# EAGLE design tableau (EAGLE 8.4.3)
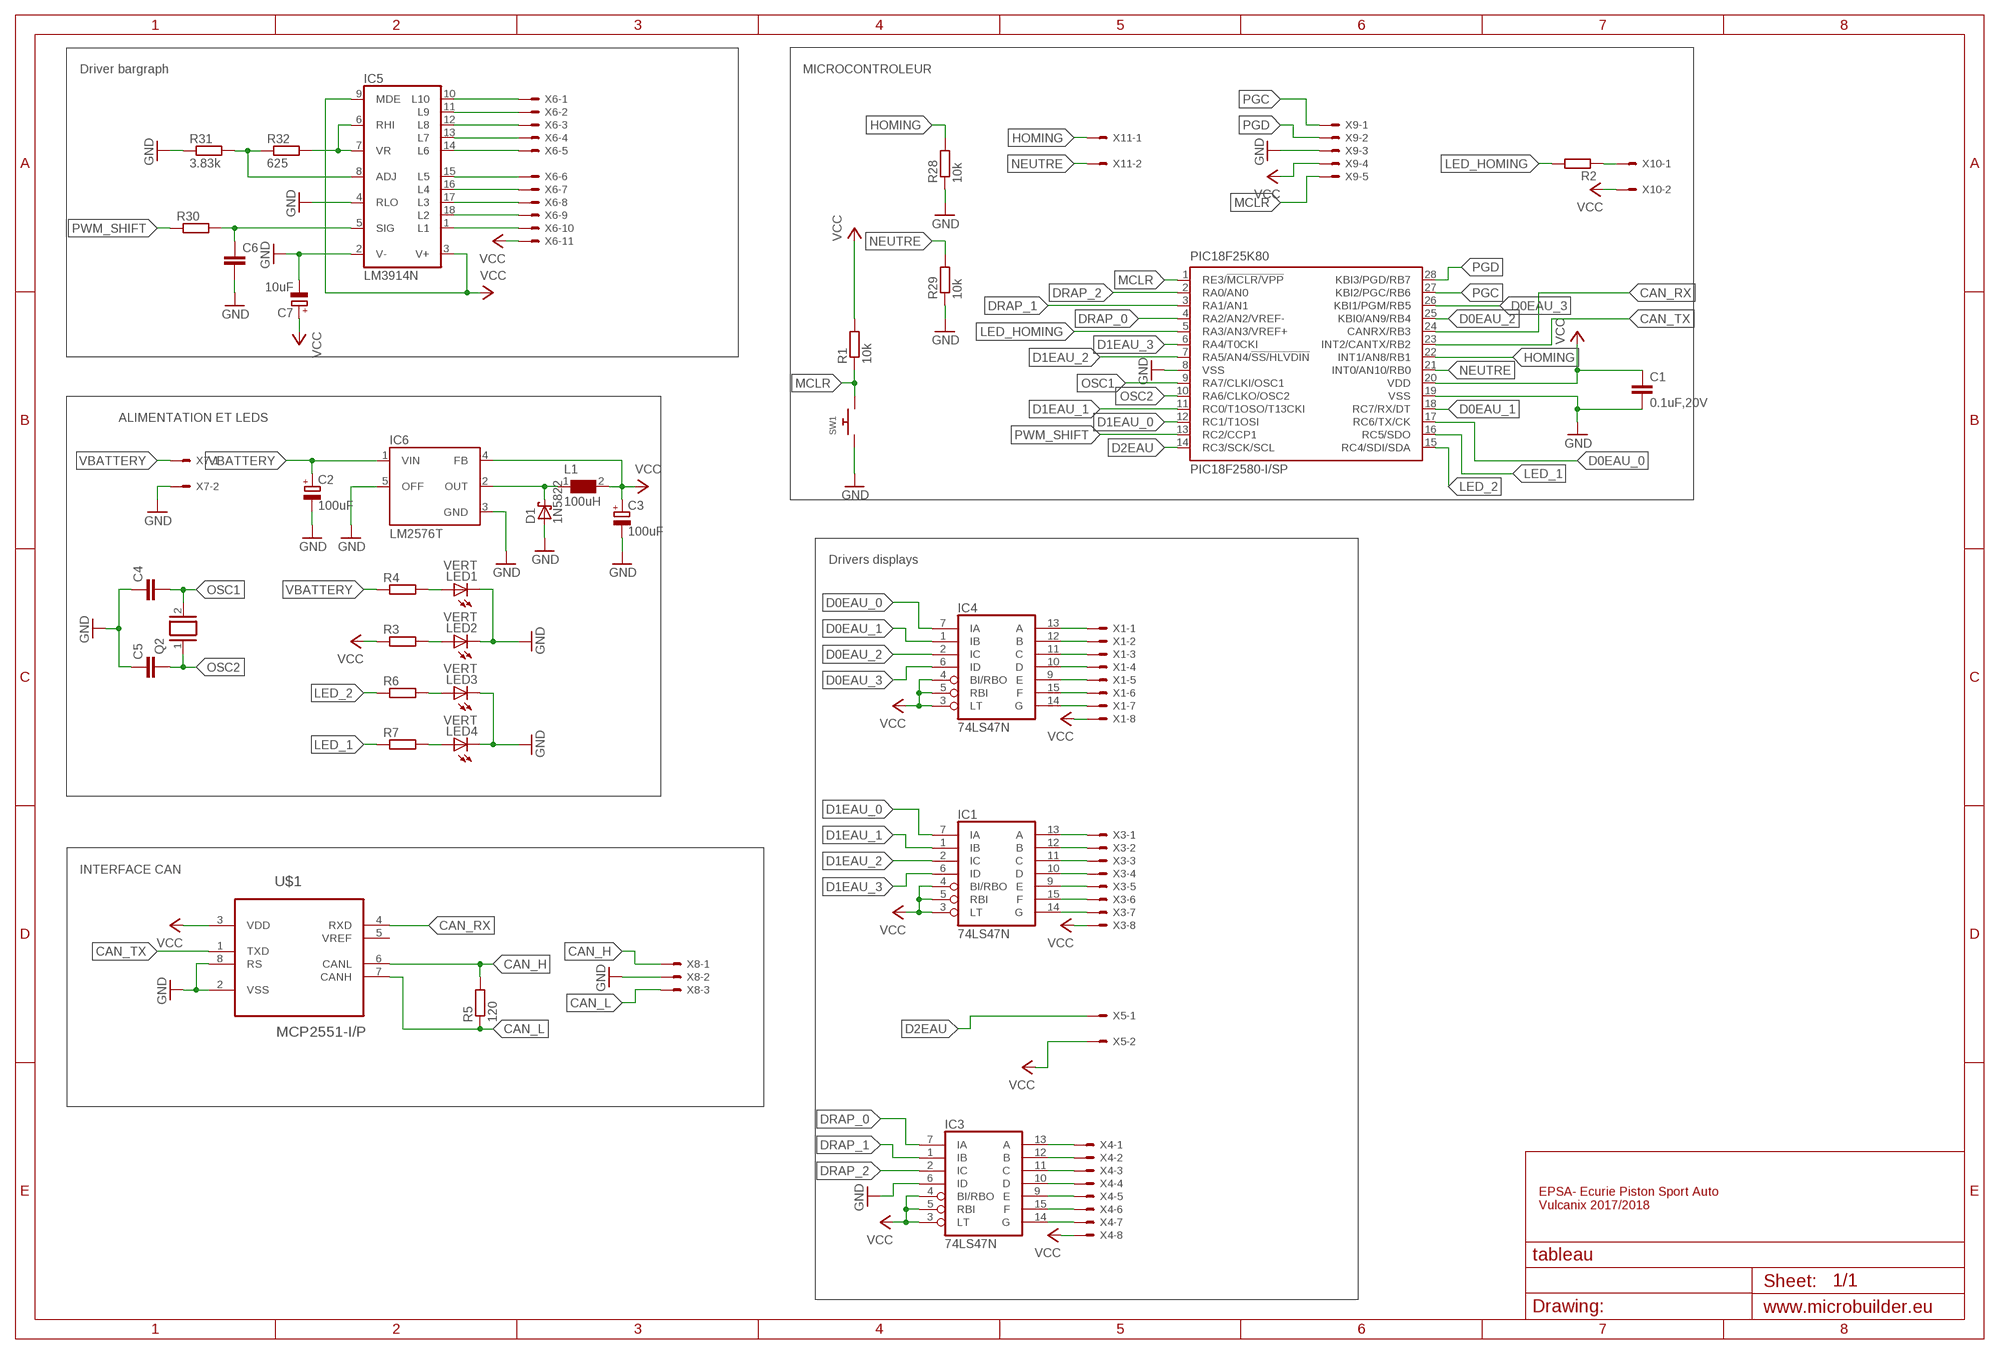
[diagram p0: schematic, sheet 1]

## Parts
C1  0.1uF,20V  C-EU025-025X050  [C025-025X050]
C2  100uF  CPOL-EUE2-5  [E2-5]
C3  100uF  CPOL-EUE2-5  [E2-5]
C4  C-EU025-030X050  [C025-030X050]
C5  C-EU025-030X050  [C025-030X050]
C6  C-EU025-025X050  [C025-025X050]
C7  10uF  CPOL-EUE2-5  [E2-5]
D1  1N5822  SCHOTTKY-DIODEDO201T15  [DO201T15]
IC1  74LS47N  [DIL16]
IC3  74LS47N  [DIL16]
IC4  74LS47N  [DIL16]
IC5  LM3914N  [DIL18]
IC6  LM2576T  [TO220-5]
L1  100uH  WE-TI-744743102_8012B  [WE-TI_8012B]
LED1  VERT  LED3MM  [LED3MM]
LED2  VERT  LED3MM  [LED3MM]
LED3  VERT  LED3MM  [LED3MM]
LED4  VERT  LED3MM  [LED3MM]
PIC18F25K80  PIC18F2580-I/SP  [DIL28-3]
Q2  XTAL/S  [QS]
R1  10k  R-EU_0204/7  [0204/7]
R2  R-EU_0204/7  [0204/7]
R3  R-EU_0204/7  [0204/7]
R4  R-EU_0204/7  [0204/7]
R5  120  R-EU_0204/7  [0204/7]
R6  R-EU_0204/7  [0204/7]
R7  R-EU_0204/7  [0204/7]
R28  10k  R-EU_0204/7  [0204/7]
R29  10k  R-EU_0204/7  [0204/7]
R30  R-EU_0204/7  [0204/7]
R31  3.83k  R-EU_0204/7  [0204/7]
R32  625  R-EU_0204/7  [0204/7]
SW1  SWITCH_PUSHBUTTONSOFTTOUCHSMD_SJ  [PUSHBUTTON_SMD_SJ]
U$1  MCP2551-I/P  [DIP254P762X432-8]
X1  KK-156-8  [KK-156-8]
X3  KK-156-8  [KK-156-8]
X4  KK-156-8  [KK-156-8]
X5  KK-156-2  [KK-156-2]
X6  KK-156-11  [KK-156-11]
X7  KK-156-2  [KK-156-2]
X8  KK-156-3  [KK-156-3]
X9  KK-156-5  [KK-156-5]
X10  KK-156-2  [KK-156-2]
X11  KK-156-2  [KK-156-2]

## Nets
CAN_H: R5.2 U$1.6(CANL) X8.1
CAN_L: R5.1 U$1.7(CANH) X8.3
CAN_RX: PIC18F25K80.24(CANRX/RB3) U$1.4(RXD)
CAN_TX: PIC18F25K80.23(INT2/CANTX/RB2) U$1.1(TXD)
D0EAU_0: IC4.7(IA) PIC18F25K80.17(RC6/TX/CK)
D0EAU_1: IC4.1(IB) PIC18F25K80.18(RC7/RX/DT)
D0EAU_2: IC4.2(IC) PIC18F25K80.25(KBI0/AN9/RB4)
D0EAU_3: IC4.6(ID) PIC18F25K80.26(KBI1/PGM/RB5)
D1EAU_0: IC1.7(IA) PIC18F25K80.12(RC1/T1OSI)
D1EAU_1: IC1.1(IB) PIC18F25K80.11(RC0/T1OSO/T13CKI)
D1EAU_2: IC1.2(IC) PIC18F25K80.7(RA5/AN4/!SS/HLVDIN)
D1EAU_3: IC1.6(ID) PIC18F25K80.6(RA4/T0CKI)
D2EAU: PIC18F25K80.14(RC3/SCK/SCL) X5.1
DRAP_0: IC3.7(IA) PIC18F25K80.4(RA2/AN2/VREF-)
DRAP_1: IC3.1(IB) PIC18F25K80.3(RA1/AN1)
DRAP_2: IC3.2(IC) PIC18F25K80.2(RA0/AN0)
GND: C1.2 C2.- C3.- C4.1 C5.1 C6.2 C7.- D1.A IC3.6(ID) IC5.2(V-) IC5.4(RLO) IC6.3(GND) IC6.5(OFF) LED1.K(C) LED2.K(C) LED3.K(C) LED4.K(C) PIC18F25K80.8(VSS) PIC18F25K80.19(VSS) R28.1 R29.1 R31.1 SW1.P$1 U$1.2(VSS) U$1.8(RS) X7.2 X8.2 X9.3
HOMING: PIC18F25K80.22(INT1/AN8/RB1) R28.2 X11.1
LED_1: PIC18F25K80.16(RC5/SDO) R7.1
LED_2: PIC18F25K80.15(RC4/SDI/SDA) R6.1
LED_HOMING: PIC18F25K80.5(RA3/AN3/VREF+) R2.2
MCLR: PIC18F25K80.1(RE3/!MCLR/VPP) R1.1 SW1.P$2 X9.5
N$1: LED1.A R4.2
N$2: IC4.13(A) X1.1
N$3: LED2.A R3.2
N$4: R2.1 X10.1
N$6: IC4.12(B) X1.2
N$7: IC4.11(C) X1.3
N$8: IC4.10(D) X1.4
N$9: IC4.9(E) X1.5
N$10: IC4.15(F) X1.6
N$11: IC4.14(G) X1.7
N$12: IC1.13(A) X3.1
N$13: IC1.12(B) X3.2
N$14: IC1.11(C) X3.3
N$15: IC1.10(D) X3.4
N$16: IC1.9(E) X3.5
N$17: IC1.15(F) X3.6
N$18: IC1.14(G) X3.7
N$19: IC3.13(A) X4.1
N$20: IC3.12(B) X4.2
N$21: IC3.11(C) X4.3
N$23: IC3.10(D) X4.4
N$24: IC3.9(E) X4.5
N$25: IC3.15(F) X4.6
N$26: IC3.14(G) X4.7
N$27: IC5.10(L10) X6.1
N$28: IC5.11(L9) X6.2
N$29: IC5.12(L8) X6.3
N$30: IC5.13(L7) X6.4
N$31: IC5.14(L6) X6.5
N$32: IC5.15(L5) X6.6
N$33: IC5.16(L4) X6.7
N$34: IC5.17(L3) X6.8
N$35: IC5.18(L2) X6.9
N$36: IC5.1(L1) X6.10
N$38: LED3.A R6.2
N$39: LED4.A R7.2
N$59: C6.1 IC5.5(SIG) R30.2
N$60: IC5.6(RHI) IC5.7(VR) R32.2
N$61: IC5.8(ADJ) R31.2 R32.1
N$62: D1.C IC6.2(OUT) L1.1
NEUTRE: PIC18F25K80.21(INT0/AN10/RB0) R29.2 X11.2
OSC1: C4.2 PIC18F25K80.9(RA7/CLKI/OSC1) Q2.2
OSC2: C5.2 PIC18F25K80.10(RA6/CLKO/OSC2) Q2.1
PGC: PIC18F25K80.27(KBI2/PGC/RB6) X9.1
PGD: PIC18F25K80.28(KBI3/PGD/RB7) X9.2
PWM_SHIFT: PIC18F25K80.13(RC2/CCP1) R30.1
VBATTERY: C2.+ IC6.1(VIN) R4.1 X7.1
VCC: C1.1 C3.+ C7.+ IC1.3(LT) IC1.4(BI/RBO) IC1.5(RBI) IC3.3(LT) IC3.4(BI/RBO) IC3.5(RBI) IC4.3(LT) IC4.4(BI/RBO) IC4.5(RBI) IC5.3(V+) IC5.9(MDE) IC6.4(FB) L1.2 PIC18F25K80.20(VDD) R1.2 R3.1 U$1.3(VDD) X1.8 X3.8 X4.8 X5.2 X6.11 X9.4 X10.2
Unconnected: U$1.5(VREF)

## Notes on the sheet
- Driver bargraph | MICROCONTROLEUR
- ALIMENTATION ET LEDS
- Drivers displays
- INTERFACE CAN
- EPSA- Ecurie Piston Sport Auto
  Vulcanix 2017/2018

## Power pins joined to a net without a drawn wire
GND: IC1.8(GND) IC3.8(GND) IC4.8(GND)
VCC: IC1.16(VCC) IC3.16(VCC) IC4.16(VCC)

## Library data of the parts
C1 C4 C5 = rcl:C-EU: CAPACITOR, European symbol
C2 C3 C7 = rcl:CPOL-EU: POLARIZED CAPACITOR, European symbol
C6 = resistor:C-EU: CAPACITOR, European symbol
D1 = diode:SCHOTTKY-DIODE: Schottky Diode
IC1 IC3 IC4 = 74xx-eu:74*47: BCD to seven segment DECODER/DRIVER Source: http://www.ee.washington.edu/stores/DataSheets/74ls/74ls47.pdf
IC5 = linear:LM3914N: LED DRIVER senses analog voltage levels and drives 10 LEDs
IC6 = v-reg-3:LM2576: National Semiconductor <http://www.national.com> 3.0A "Simple Switcher"(c) 52kHz, Vout 1.23-37V (HV: 57V), Vin 40V (HV: 60V), 50µA standby current
L1 = WE-TI:WE-TI: Radial Leaded Wire Wound Inductor WE-TI - Radial through-hole inductor - High saturation core material - Small size - maximum current up to 7,5 A -- Signal filtering -- NF-switches, switching power supply for small and medium voltage -- Power supply filter; MPN: 744743102; OC_FARNELL: 2211743; OC_NEWARK: 44W4682; PACKAGE: 8012-B; SUPPLIER: WURTH ELEKTRONIK
LED1-LED4 = led:LED: LED OSRAM: - CHIPLED LG R971, LG N971, LY N971, LG Q971, LY Q971, LO R971, LY R971 LH N974, LH R974 LS Q976, LO Q976, LY Q976 LO Q996 - Hyper CHIPLED LW Q18S LB Q993, LB Q99A, LB R99A - SideLED LS A670, LO A670, LY A670, LG A670, LP A670 LB A673, LV A673, LT A673, LW A673 LH A674 LY A675 LS A676, LA A676, LO A676, LY A676, LW A676 LS A679, LY A679, LG A679 - Hyper Micro SIDELED® LS Y876, LA Y876, LO Y876, LY Y876 LT Y87S - SmartLED LW L88C, LW L88S LB L89C, LB L89S, LG L890 LS L89K, LO L89K, LY L89K LS L896, LA L896, LO L896, LY L896 - TOPLED LS T670, LO T670, LY T670, LG T670, LP T670 LSG T670, LSP T670, LSY T670, LOP T670, LYG T670 LG T671, LOG T671, LSG T671 LB T673, LV T673, LT T673, LW T673 LH T674 LS T676, LA T676, LO T676, LY T676, LB T676, LH T676, LSB T676, LW T676 LB T67C, LV T67C, LT T67C, LS T67K, LO T67K, LY T67K, LW E67C LS E67B, LA E67B, LO E67B, LY E67B, LB E67C, LV E67C, LT E67C LW T67C LS T679, LY T679, LG T679 LS T770, LO T770, LY T770, LG T770, LP T770 LB T773, LV T773, LT T773, LW T773 LH T774 LS E675, LA E675, LY E675, LS T675 LS T776, LA T776, LO T776, LY T776, LB T776 LHGB T686 LT T68C, LB T68C - Hyper Mini TOPLED® LB M676 - Mini TOPLED Santana® LG M470 LS M47K, LO M47K, LY M47K Source: http://www.osram.convergy.de LUXEON: - LUMILED® LXK2-PW12-R00, LXK2-PW12-S00, LXK2-PW14-U00, LXK2-PW14-V00 LXK2-PM12-R00, LXK2-PM12-S00, LXK2-PM14-U00 LXK2-PE12-Q00, LXK2-PE12-R00, LXK2-PE12-S00, LXK2-PE14-T00, LXK2-PE14-U00 LXK2-PB12-K00, LXK2-PB12-L00, LXK2-PB12-M00, LXK2-PB14-N00, LXK2-PB14-P00, LXK2-PB14-Q00 LXK2-PR12-L00, LXK2-PR12-M00, LXK2-PR14-Q00, LXK2-PR14-R00 LXK2-PD12-Q00, LXK2-PD12-R00, LXK2-PD12-S00 LXK2-PH12-R00, LXK2-PH12-S00 LXK2-PL12-P00, LXK2-PL12-Q00, LXK2-PL12-R00 Source: www.luxeon.com KINGBRIGHT: KA-3528ASYC Source: www.kingbright.com
PIC18F25K80 = microchip:PIC18F2*80: 28-Pin Enhanced Flash Microcontrollers with ECAN(TM) Technology 10-Bit A/D and nanoWatt Technology Source: http://www.microchip.com .. 39637a.pdf; MF: MICROCHIP; MPN: PIC18F2580-I/SP; OC_FARNELL: 9321276; OC_NEWARK: 71J7244
Q2 = special:XTAL/S: CRYSTAL
R1-R7 R28-R32 = resistor:R-EU_: RESISTOR, European symbol
SW1 = microbuilder:SWITCH_PUSHBUTTON: Buttons SOFTTOUCHSMD_SJ - Soft touch temporary push button (Super Junk Akihabara) Compatible with SKPMANE010 [Mouser: 688-SKPMAN]
U$1 = mcp2551:MCP2551-I/P: High-Speed CAN Transceiver; DESCRIPTION: CAN CTRL; MPN: MCP2551-I/P; OC_FARNELL: 1292240; OC_NEWARK: 61K2947; PACKAGE: PDIP-8; SUPPLIER: Microchip
X1 X3 X4 = con-molex:KK-156-8: KK 156 HEADER Source: http://www.molex.com/pdm_docs/sd/026604100_sd.pdf; OC_FARNELL: unknown; OC_NEWARK: unknown
X5 X7 X10 X11 = con-molex:KK-156-2: KK 156 HEADER Source: http://www.molex.com/pdm_docs/sd/026604100_sd.pdf; OC_FARNELL: unknown; OC_NEWARK: unknown
X6 = con-molex:KK-156-11: KK 156 HEADER Source: http://www.molex.com/pdm_docs/sd/026604100_sd.pdf; OC_FARNELL: unknown; OC_NEWARK: unknown
X8 = con-molex:KK-156-3: KK 156 HEADER Source: http://www.molex.com/pdm_docs/sd/026604100_sd.pdf; OC_FARNELL: unknown; OC_NEWARK: unknown
X9 = con-molex:KK-156-5: KK 156 HEADER Source: http://www.molex.com/pdm_docs/sd/026604100_sd.pdf; OC_FARNELL: unknown; OC_NEWARK: unknown

## Net classes
0 default: width 0.356 mm, clearance 0.356 mm

## Board
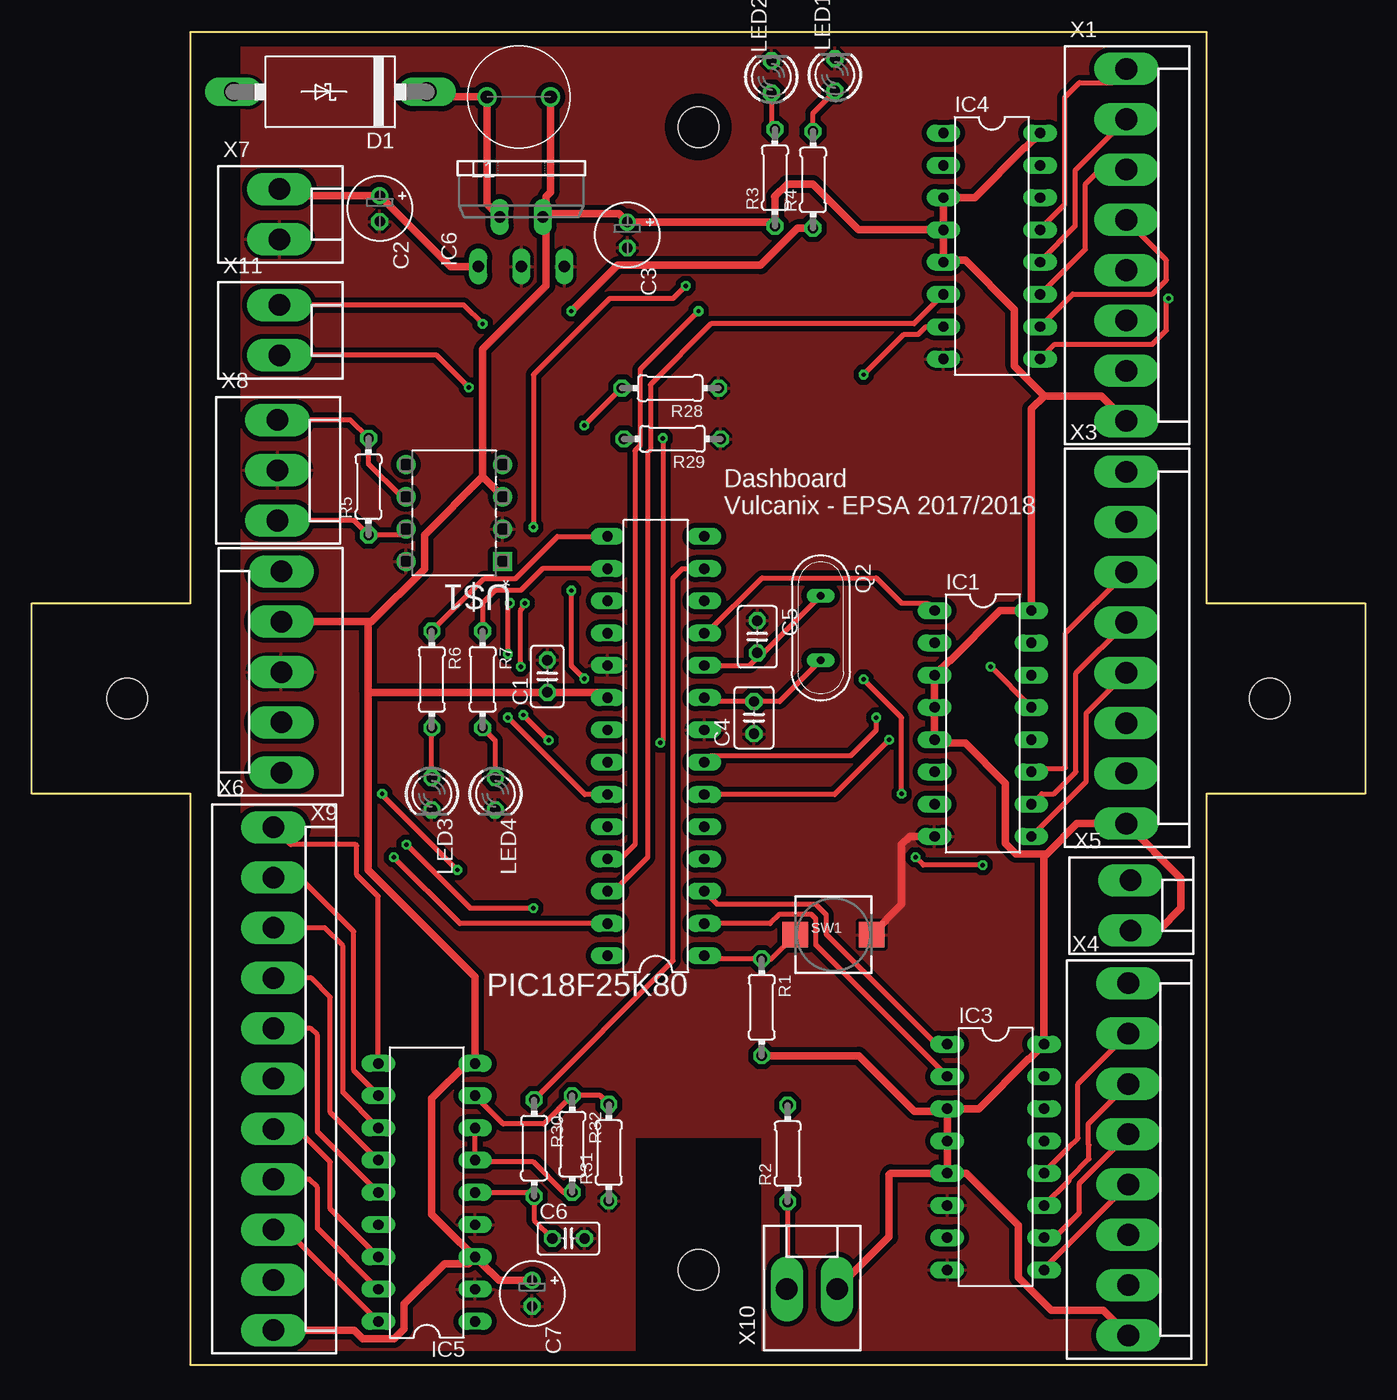
[diagram p1: board, top side]
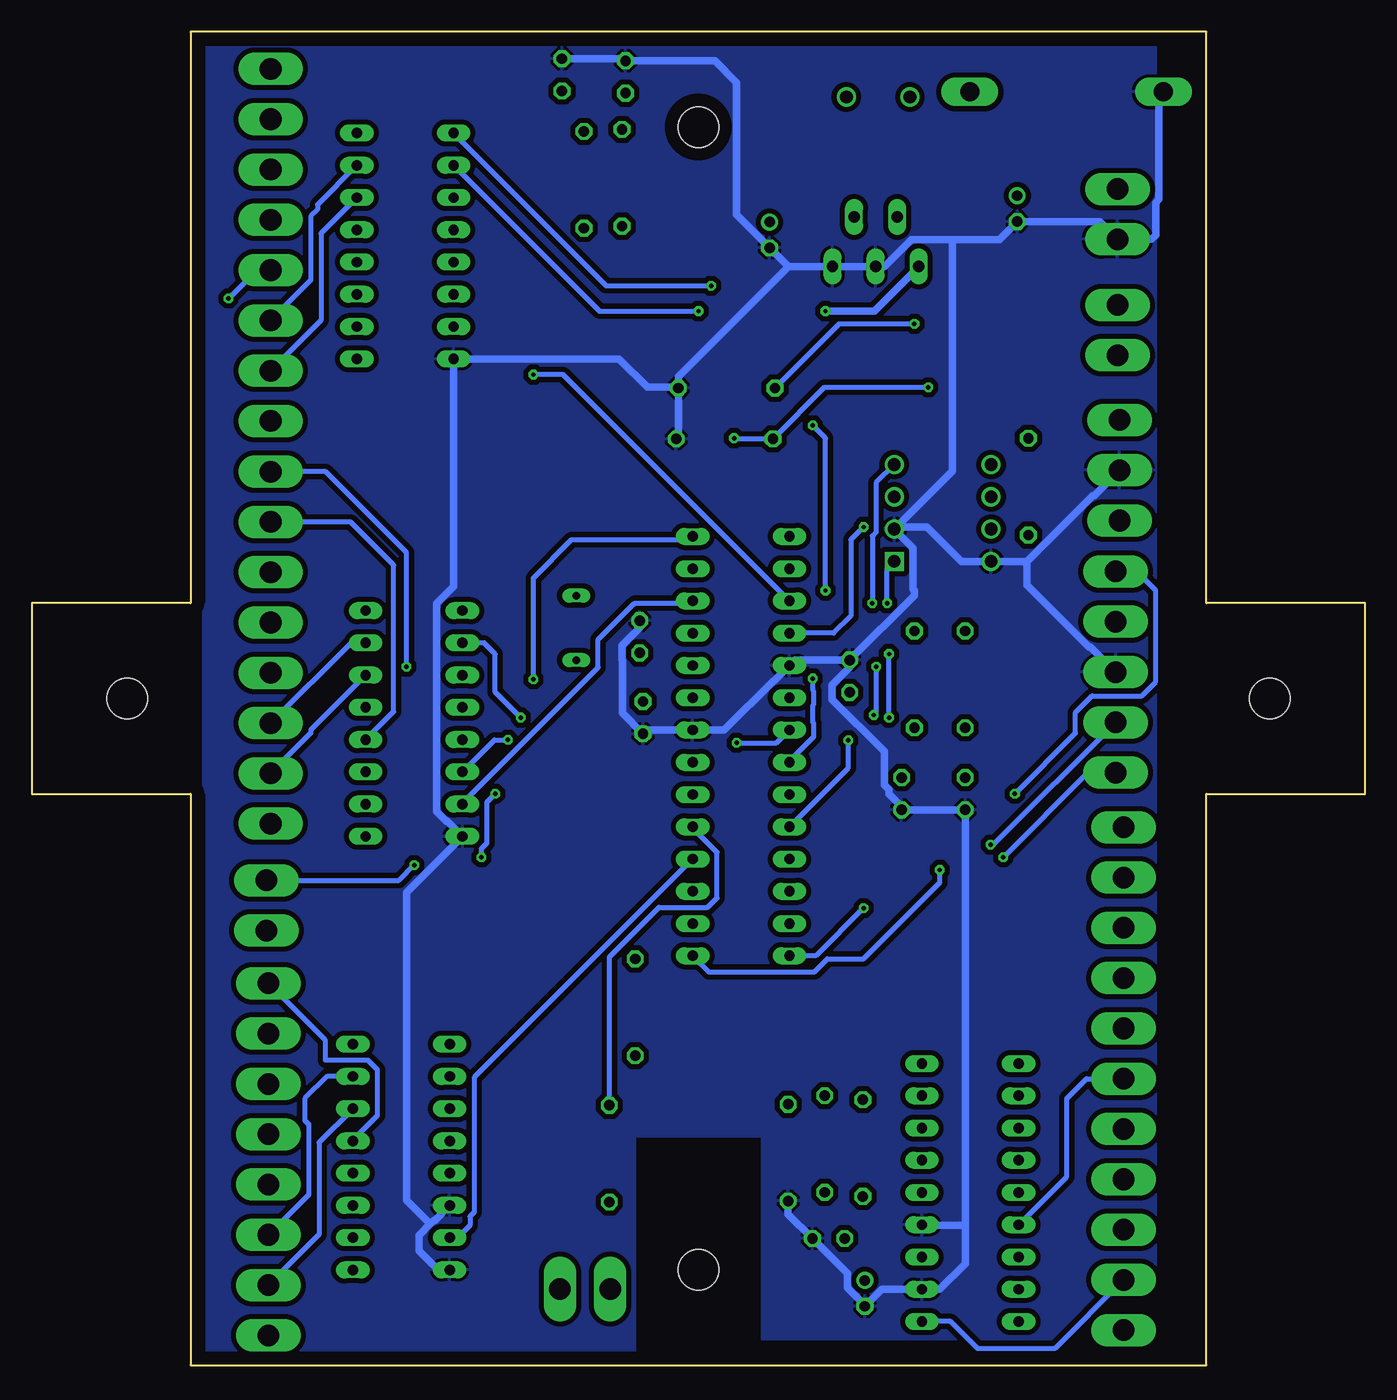
[diagram p2: board, bottom side, seen from below]

Size 105 x 105 mm. Coordinates in mm from the lower left corner, seen from the top.
Outline: 12.5,105 92.5,105 92.5,60 105,60 105,45 92.5,45 92.5,0 12.5,0 12.5,45 0,45 0,60 12.5,60 12.5,105
Copper layers (1*16): Top 0.035mm / dielectric 1.5mm / Bottom 0.035mm
Design rules "default *": minimum track width 6mil, minimum drill 0.35mm, track to track 16mil, track to pad 16mil, pad to pad 16mil, via to via 16mil, smd to smd 6mil, copper to edge 40mil, drill to drill 6mil, minimum pad ring 10mil, minimum via ring 8mil, stop-mask expansion 4mil, vias tented up to drill 0mil, thermal gap 10mil
Holes 3.2 mm at 7.5,52.5 97.5,52.5 52.5,97.5 52.5,7.5

### Footprints (pad centres in the part's own frame; a part is rotated, then mirrored left to right if it is on the bottom)
C025-025X050 = drill 0.813 octagon: 1 -1.27,0; 2 1.27,0
E2-5 = drill 0.813 pad 1.27: + -1.016,0 | drill 0.813 pad 1.27 octagon: - 1.016,0
C025-030X050 = drill 0.813 octagon: 1 -1.27,0; 2 1.27,0
DO201T15 = drill 1.499 long: A 7.62,0; C -7.62,0
DIL16 = drill 0.813 long: 1 -8.89,-3.81; 2 -6.35,-3.81; 3 -3.81,-3.81; 4 -1.27,-3.81; 5 1.27,-3.81; 6 3.81,-3.81; 7 6.35,-3.81; 8 8.89,-3.81; 9 8.89,3.81; 10 6.35,3.81; 11 3.81,3.81; 12 1.27,3.81; 13 -1.27,3.81; 14 -3.81,3.81; 15 -6.35,3.81; 16 -8.89,3.81
DIL18 = drill 0.813 long: 1 -10.16,-3.81; 2 -7.62,-3.81; 3 -5.08,-3.81; 4 -2.54,-3.81; 5 0,-3.81; 6 2.54,-3.81; 7 5.08,-3.81; 8 7.62,-3.81; 9 10.16,-3.81; 10 10.16,3.81; 11 7.62,3.81; 12 5.08,3.81; 13 2.54,3.81; 14 0,3.81; 15 -2.54,3.81; 16 -5.08,3.81; 17 -7.62,3.81; 18 -10.16,3.81
TO220-5 = drill 0.9 long: 1 -3.4,-8.4; 2 -1.7,-4.5; 3 0,-8.4; 4 1.7,-4.5; 5 3.4,-8.4
WE-TI_8012B = drill 1: 1 -2.5,0; 2 2.5,0
LED3MM = drill 0.813 octagon: A -1.27,0; K 1.27,0
DIL28-3 = drill 0.813 long: 1 -16.51,-3.81; 2 -13.97,-3.81; 3 -11.43,-3.81; 4 -8.89,-3.81; 5 -6.35,-3.81; 6 -3.81,-3.81; 7 -1.27,-3.81; 8 1.27,-3.81; 9 3.81,-3.81; 10 6.35,-3.81; 11 8.89,-3.81; 12 11.43,-3.81; 13 13.97,-3.81; 14 16.51,-3.81; 15 16.51,3.81; 16 13.97,3.81; 17 11.43,3.81; 18 8.89,3.81; 19 6.35,3.81; 20 3.81,3.81; 21 1.27,3.81; 22 -1.27,3.81; 23 -3.81,3.81; 24 -6.35,3.81; 25 -8.89,3.81; 26 -11.43,3.81; 27 -13.97,3.81; 28 -16.51,3.81
QS = drill 0.61 long: 1 -2.54,0; 2 2.54,0
0204/7 = drill 0.813 octagon: 1 -3.81,0; 2 3.81,0
PUSHBUTTON_SMD_SJ = smd 2 x 2: P$1 3,0; P$2 -3,0
DIP254P762X432-8 = drill 0.991 square: 1 -7.62,7.62 | drill 0.991: 2 -7.62,5.08; 3 -7.62,2.54; 4 -7.62,0; 5 0,0; 6 0,2.54; 7 0,5.08; 8 0,7.62
KK-156-8 = drill 1.7 pad 2.184 long: 1 -13.86,0; 2 -9.9,0; 3 -5.94,0; 4 -1.98,0; 5 1.98,0; 6 5.94,0; 7 9.9,0; 8 13.86,0
KK-156-2 = drill 1.7 pad 2.184 long: 1 -1.98,0; 2 1.98,0
KK-156-11 = drill 1.7 pad 2.184 long: 1 -19.8,0; 2 -15.84,0; 3 -11.88,0; 4 -7.92,0; 5 -3.96,0; 6 0,0; 7 3.96,0; 8 7.92,0; 9 11.88,0; 10 15.84,0; 11 19.8,0
KK-156-3 = drill 1.7 pad 2.184 long: 1 -3.96,0; 2 0,0; 3 3.96,0
KK-156-5 = drill 1.7 pad 2.184 long: 1 -7.92,0; 2 -3.96,0; 3 0,0; 4 3.96,0; 5 7.92,0

### Placement (x,y rotation side)
C1  40.6,54.25 90 top
C2  27.4,91.07 270 top
C3  46.9,89 270 top
C4  56.87,50.99 90 top
C5  57.13,57.36 270 top
C6  42.26,9.98 0 top
C7  39.4,5.66 270 top
D1  23.51,100.26 180 top
IC1  74.9,50.53 270 top
IC3  75.9,16.39 270 top
IC4  75.6,88.13 270 top
IC5  31.1,13.6 90 top
IC6  38.55,94.91 0 top
L1  38.35,99.87 0 top
LED1  63.25,101.6 90 top
LED2  58.25,101.44 90 top
LED3  31.5,45 270 top
LED4  36.5,45 270 top
PIC18F25K80  49.15,48.75 90 top
Q2  62.13,58.05 270 top
R1  57.48,28.18 270 top
R2  59.52,16.66 90 top
R3  58.52,93.5 90 top
R4  61.52,93.34 90 top
R5  26.52,69.18 90 top
R6  31.5,54 270 top
R7  35.5,54 270 top
R28  50.28,76.94 180 top
R29  50.44,72.94 180 top
R30  39.56,17.1 270 top
R31  45.44,16.74 90 top
R32  42.56,17.42 270 top
SW1  63.13,33.9 0 top
U$1  29.46,70.92 180 top
X1  86.19,88.21 270 top
X3  86.19,56.5 270 top
X4  86.35,16.21 270 top
X5  86.51,36.21 270 top
X6  19.03,22.56 270 top
X7  19.51,90.64 270 top
X8  19.35,70.47 270 top
X9  19.65,54.58 90 top
X10  61.43,6.01 0 top
X11  19.51,81.5 270 top

### Tracks (layer width: path | path; a pad name or v marks a point on that pad's centre or on a via)
CAN_H
  Top 0.406: U$1.6 29.12,68.38 26.5,71 26.52,71.02 R5.2 25.08,74.43 X8.1
CAN_L
  Top 0.406: U$1.7 28.99,65.37 R5.1 25.38,66.51 X8.3
CAN_RX  (via drill 0.35)
  Top 0.406: v40.7,49.2 v38.7,51.2 | v38.5,55 38.5,59.47 38.64,59.6 38.64,59.83 v38.81,60
  Bottom 0.406: PIC18F25K80.24 40.7,47.04 v40.7,49.2 | v38.7,51.2 38.5,51.4 v38.5,55 | v38.81,60 38.81,65.29 38.51,65.59 38.51,69.49 U$1.4
CAN_TX  (via drill 0.35)
  Top 0.406: PIC18F25K80.23 43.56,44.94 v37.5,51 | v37.5,56 37.5,59.86 v37.65,60.01
  Bottom 0.406: v37.5,51 v37.5,56 | v37.65,60.01 37.65,62.73 U$1.1
D0EAU_0  (via drill 0.35)
  Top 0.406: v65.5,78 68.69,81.19 69.81,81.19 70.4,81.78 IC4.7
  Bottom 0.406: PIC18F25K80.17 63.16,78 v65.5,78
D0EAU_1  (via drill 0.35)
  Top 0.406: v51.5,85 50.5,84 45.5,84 39.5,78 v39.5,66
  Bottom 0.406: IC4.1 59.77,85 v51.5,85 | v39.5,66 40.5,65 40.5,59 41.86,57.64 PIC18F25K80.18
D0EAU_2  (via drill 0.35)
  Top 0.406: v52.5,83 47.9,78.4 47.9,72.41 47.5,72.01 47.5,41 46.36,39.86 PIC18F25K80.25
  Bottom 0.406: IC4.2 60.31,83 v52.5,83
D0EAU_3
  Top 0.406: IC4.6 69.47,82 53.5,82 48.71,77.21 48.71,72.08 48.5,71.86 48.5,40 45.82,37.32 PIC18F25K80.26
D1EAU_0
  Bottom 0.406: IC1.7 71.09,44.26 60.4,54.95 60.4,57.15 57.66,59.9 57.6,59.9 57.5,60 53.14,60 PIC18F25K80.12
D1EAU_1
  Top 0.406: PIC18F25K80.11 53.14,57.64 57.5,62 66.5,62 68.5,60 70.51,60 IC1.1
D1EAU_2  (via drill 0.35)
  Top 0.406: PIC18F25K80.7 53.48,48 64.5,48 66.5,50 v66.5,51
  Bottom 0.406: v66.5,51 68.5,53 68.5,56 69.38,56.88 IC1.2
D1EAU_3  (via drill 0.35)
  Top 0.406: v67.51,49.24 63.21,44.94 PIC18F25K80.6
  Bottom 0.406: IC1.6 68.57,49.24 v67.51,49.24
D2EAU  (via drill 0.35)
  Top 0.406: v74.89,39.39 70.2,39.39 v69.59,40 | v68.5,45 68.5,51 v65.5,54
  Bottom 0.406: X5.1 76.08,38.19 v74.89,39.39 | v69.59,40 69.59,40.68 69.16,41.11 69.16,44.34 v68.5,45 | v65.5,54 65.5,62 62.5,65 53.22,65 PIC18F25K80.14
DRAP_0
  Bottom 0.406: PIC18F25K80.4 70.16,22.66 70.16,12.05 70.5,11.71 70.5,11 71.46,10.04 IC3.7
DRAP_1
  Top 0.406: PIC18F25K80.3 53.96,36.32 61.72,36.32 62.55,35.49 62.55,33.95 71.22,25.28 IC3.1
DRAP_2
  Top 0.406: IC3.2 61.74,33.09 61.74,35.15 61.38,35.51 58.88,35.51 58.15,34.78 PIC18F25K80.2
GND
  Top 0.61: SW1.P$1 68.5,36.27 68.5,41 69.14,41.64 IC1.8
  Bottom 0.61: D1.A 16.25,99.9 16.25,91.8 16.5,91.55 16.5,89 16.84,88.66 X7.2 20.9,90.05 C2.- 28.82,88.63 32.5,88.63 | 45.43,86.51 IC6.5 IC6.3 37.85,86.51 35.74,88.63 32.5,88.63 | 45.43,86.51 C3.- 49.5,90.58 49.5,101 51.21,102.71 LED2.K 58.41,102.87 LED1.K | X8.2 21.32,68.5 21.45,68.5 26.64,63.3 | 26.64,63.3 U$1.8 31.8,63.3 34.5,66 36.92,66 U$1.2 | R31.1 45.44,11.89 C6.2 40.77,7.22 40.77,6.11 39.4,4.74 C7.- 38.06,5.98 IC5.2 33.52,5.98 31.5,8 31.5,11 | X9.3 21.62,56.55 21.75,56.55 26.64,61.45 26.64,63.3 | 45.43,86.51 54.09,77.85 R28.1 | R28.1 54.15,77 56.5,77 58.74,79.24 IC4.8 71.79,61.32 73.12,59.99 73.12,43.61 72.32,42.81 72.26,42.81 IC1.8 75.5,37.23 75.5,13 73.61,11.12 | R28.1 54.09,73.1 R29.1 | IC3.6 73.26,11.41 73.32,11.41 73.61,11.12 | 73.61,11.12 74.5,10.23 74.5,9 73,7.5 IC3.8 | C1.2 44.92,55.52 PIC18F25K80.19 46.51,53.93 46.57,53.93 50.48,50.02 PIC18F25K80.8 56.57,50.02 C4.1 58.5,51.35 58.5,55.52 58.5,56.66 57.13,58.03 C5.1 | U$1.2 32.5,70.42 32.5,88.63 | U$1.2 37.08,65.8 35.62,64.34 35.62,61.12 35.5,61 35.5,60.62 C1.2 | C1.2 40.6,54.92 41.97,53.55 41.97,52.41 37.87,48.31 37.87,45.7 37.5,45.33 37.5,45 36.5,44 LED4.K LED3.K 31.5,11 | IC5.4 34.85,11 31.5,11
  pour Top: 16.5,1 47.5,1 47.5,18 57.5,18 57.5,1 91.5,1 91.5,104 16.5,104
  pour Bottom: 16.5,2 47.5,2 47.5,18 57.5,18 57.5,1 91.5,1 91.5,104 16.5,104
HOMING  (via drill 0.35)
  Top 0.406: v35.5,82 34.02,83.48 X11.1 | v43.5,54.07 42.5,55.07 v42.5,61 | v43.5,74 46.44,76.94 R28.2
  Bottom 0.406: R28.2 41.41,82 v35.5,82 | PIC18F25K80.22 45.34,47.56 43.41,49.49 43.41,50.55 43.5,50.64 43.5,51.94 43.41,52.03 43.41,53.09 43.5,53.18 v43.5,54.07 | v42.5,61 42.5,73 v43.5,74
LED_1
  Top 0.406: PIC18F25K80.16 40.22,62.72 38.5,61 36.5,61 35.5,60 R7.1
LED_2
  Top 0.406: R6.1 35.63,61.94 38.08,61.94 41.4,65.26 PIC18F25K80.15
LED_HOMING
  Bottom 0.406: R2.2 59.52,32.15 55.62,36.05 51.77,36.05 51.03,36.79 51.03,40.39 52.96,42.32 PIC18F25K80.5
MCLR  (via drill 0.35)
  Top 0.406: SW1.P$2 58.22,31.99 R1.1 53.21,31.99 PIC18F25K80.1 | v33.5,39 27.59,44.91 v27.59,45
  Bottom 0.406: PIC18F25K80.1 51.69,30.97 43.38,30.97 42.35,32 39.5,32 33.5,38 v33.5,39 | v27.59,45 22.81,49.78 22.81,51.4 21.52,52.7 17.59,52.7 16.49,53.8 16.49,59.32 16.5,59.33 16.5,61 18,62.5 X9.5
N$1
  Top 0.406: R4.2 61.52,98.6 LED1.A
N$2
  Top 0.406: IC4.13 79.41,89.48 81.34,91.41 81.34,99.84 82.5,101 85.12,101 X1.1
N$3
  Top 0.406: LED2.A 58.25,97.58 R3.2
N$4
  Top 0.406: R2.1 59.52,6.08 X10.1
N$6
  Top 0.406: X1.2 82.15,94.07 82.15,89.69 79.41,86.94 IC4.12
N$7
  Top 0.406: IC4.11 82.97,87.88 82.97,93 84.12,94.15 X1.3
N$8
  Top 0.406: IC4.10 81.97,84.34 88.25,84.34 89.35,85.45 89.35,87.01 86.19,90.17 X1.4
N$9  (via drill 0.35)
  Top 0.406: IC4.9 80.56,80.39 88.25,80.39 89.35,81.49 89.35,83.85 v89.5,84
  Bottom 0.406: v89.5,84 87.27,86.23 X1.5
N$10
  Bottom 0.406: IC4.15 82.5,91.39 82.5,91 83.03,90.47 83.03,85.45 84.13,84.34 84.16,84.34 86.23,82.27 X1.6
N$11
  Bottom 0.406: IC4.14 82.22,89.13 82.22,82.3 86.19,78.33 X1.7
N$12  (via drill 0.35)
  Top 0.406: IC1.13 v75.51,55 v75.5,55
  Bottom 0.406: v75.5,55 75.5,64 81.86,70.36 X3.1
N$13
  Bottom 0.406: IC1.12 76.5,51.47 76.5,63 79.9,66.4 X3.2
N$14
  Top 0.406: IC1.11 78.99,47 81.35,47 81.41,47.05 81.41,57.63 86.19,62.42 X3.3
N$15
  Top 0.406: IC1.10 79.53,45 80.5,45 82.22,46.72 82.22,54.49 86.19,58.46 X3.4
N$16
  Top 0.406: IC1.9 83.03,45.96 83.03,51.34 86.19,54.5 X3.5
N$17
  Bottom 0.406: X3.6 79.87,56.88 IC1.15
N$18
  Bottom 0.406: IC1.14 83.03,50.02 83.03,49.78 86.19,46.62 X3.7
N$19
  Bottom 0.406: X4.1 86.35,30.05 81.87,25.57 81.87,24.01 78.52,24.01 77.78,23.27 77.78,19.67 79.71,17.74 IC3.13
N$20
  Top 0.406: IC3.12 79.71,15.2 81.64,17.13 81.64,17.14 82.38,17.88 82.38,22.14 X4.2
N$21
  Top 0.406: IC3.11 81.69,14.56 81.69,14.68 83.25,16.25 83.25,17.34 83.19,17.41 83.19,18.99 X4.3
N$23
  Top 0.406: IC3.10 80.54,10.04 82.5,12 82.5,14.34 X4.4
N$24
  Top 0.406: X4.5 81.64,9.52 81.64,9.51 79.71,7.58 IC3.9
N$25
  Bottom 0.406: IC3.15 81.76,22.74 83.5,21 83.5,19.28 83.19,18.97 83.19,13.43 X4.6
N$26
  Bottom 0.406: IC3.14 82.38,17.53 82.38,10.3 86.35,6.33 X4.7
N$27
  Top 0.406: IC5.10 27.29,36.92 25.59,38.62 25.59,40.91 25.5,41 20.39,41 X6.1
N$28
  Top 0.406: IC5.11 27.29,21.3 25.36,23.23 25.36,34.14 21.5,38 19.43,38 X6.2
N$29
  Top 0.406: IC5.12 24.5,21.47 24.5,33 23.06,34.44 X6.3
N$30
  Top 0.406: IC5.13 23.5,19.93 23.5,29 22.02,30.48 X6.4
N$31
  Top 0.406: IC5.14 22.5,18.39 22.5,26 21.98,26.52 X6.5
N$32
  Bottom 0.406: IC5.15 23.5,14.85 23.5,21 21.94,22.56 X6.6
N$33
  Top 0.406: IC5.16 23.5,12.31 23.5,16 20.9,18.6 X6.7
N$34
  Top 0.406: IC5.17 22.5,10.77 22.5,14 21.86,14.64 X6.8
N$35
  Top 0.406: IC5.18 20.05,10.68 X6.9
N$36
  Bottom 0.406: X6.10 24.45,1.29 30.5,1.29 32.65,3.44 IC5.1
N$38
  Top 0.406: LED3.A R6.2
N$39
  Top 0.406: R7.2 36.5,49.19 LED4.A
N$59
  Top 0.406: IC5.5 39.25,13.6 R30.2 39.56,11.41 C6.1
N$60
  Top 0.406: IC5.7 IC5.6 35.05,16 39.5,16 41.89,13.61 R32.2
N$61
  Top 0.406: R31.2 44.76,21.23 R32.1 40.33,19 37.13,19 IC5.8
N$62
  Top 0.61: IC6.2 35.85,91.41 L1.1 31.52,99.87 D1.C
NEUTRE  (via drill 0.35)
  Top 0.406: v34.41,77 31.89,79.52 X11.2 | v49.7,73 49.7,49.2 v49.5,49
  Bottom 0.406: v34.41,77 42.57,77 R29.2 49.64,72.94 v49.7,73 | v49.5,49 46.36,49 PIC18F25K80.21
OSC1
  Top 0.406: Q2.2 58.88,52.26 C4.2 53.26,52.26 PIC18F25K80.9
OSC2
  Top 0.406: 57.5,56.09 C5.2 | 57.5,56.09 57.63,56.09 Q2.1 | PIC18F25K80.10 56.51,55.1 57.5,56.09
PGC  (via drill 0.35)
  Top 0.406: PIC18F25K80.27 33.72,34.78 v28.5,40
  Bottom 0.406: v28.5,40 21.84,46.66 X9.1
PGD  (via drill 0.35)
  Top 0.406: v29.5,41 34.5,36 v39.5,36
  Bottom 0.406: X9.2 29.27,41 v29.5,41 | v39.5,36 43.26,32.24 PIC18F25K80.28
PWM_SHIFT
  Top 0.406: R30.1 50.51,31.86 50.51,62 51.23,62.72 PIC18F25K80.13
VBATTERY  (via drill 0.35)
  Top 0.61: IC6.1 32.98,86.51 C2.+ 20.04,92.09 X7.1 | R4.1 60.3,89.53 57.38,86.61 46.11,86.61 v42.5,83
  Bottom 0.61: v42.5,83 38.66,83 IC6.1
VCC
  Top 0.61: L1.2 40.85,92.35 40.5,92 40.5,90.66 | 40.5,90.66 IC6.4 40.5,90.16 40.5,85 35.5,80 35.5,69.96 | 40.5,90.66 46.26,90.66 C3.+ 58.19,90.02 R3.1 58.52,91.98 58.5,92 59.5,93 61.5,93 65.1,89.4 IC4.4 | IC4.4 IC4.5 71.93,87 73.5,87 77.38,83.12 77.38,78.67 79.73,76.32 | IC4.4 IC4.3 74.27,91.94 78.18,95.85 78.24,95.85 IC4.16 | 35.5,69.96 U$1.3 | X1.8 84.22,76.32 79.73,76.32 | X4.8 84.38,4.32 80.29,4.32 77.68,6.93 77.68,11.02 73.58,15.12 IC3.5 | IC3.5 IC3.4 IC3.3 | IC3.3 74.57,20.2 78.48,24.11 78.54,24.11 IC3.16 79.71,40.04 80.08,40.41 | IC5.3 36.08,7.35 36.14,7.35 36.81,6.68 C7.+ | X6.11 25.37,2.76 26.06,2.07 28.52,2.07 29.32,2.87 29.32,4.82 32.5,8 34.39,8 IC5.3 | 35.5,69.96 30.92,65.38 30.92,62.7 26.77,58.54 26.5,58.54 | 26.5,58.54 X9.4 | 80.08,40.41 82.31,42.64 X3.8 90.5,38.33 90.5,36 88.73,34.23 X5.2 | 80.08,40.41 79.94,40.27 77.48,40.27 76.68,41.07 76.68,45.82 73.5,49 71.35,49 IC1.5 IC1.4 IC1.3 72.26,55.51 72.32,55.51 76.23,59.42 IC1.16 78.71,75.31 79.73,76.32 | IC5.3 33.74,9.69 33.68,9.69 31.5,11.87 31.5,21 34.26,23.76 IC5.9 34.91,30.59 26.5,39 26.5,53 | 26.5,53 26.5,58.54 | R1.2 65.13,24.37 69.5,20 71.89,20 IC3.3 | X10.2 67.5,10.1 67.5,15 67.62,15.12 IC3.5 | PIC18F25K80.20 44.92,52.98 C1.1 26.52,52.98 26.5,53

### Text on the board
tPlace: Dashboard / Vulcanix - EPSA 2017/2018